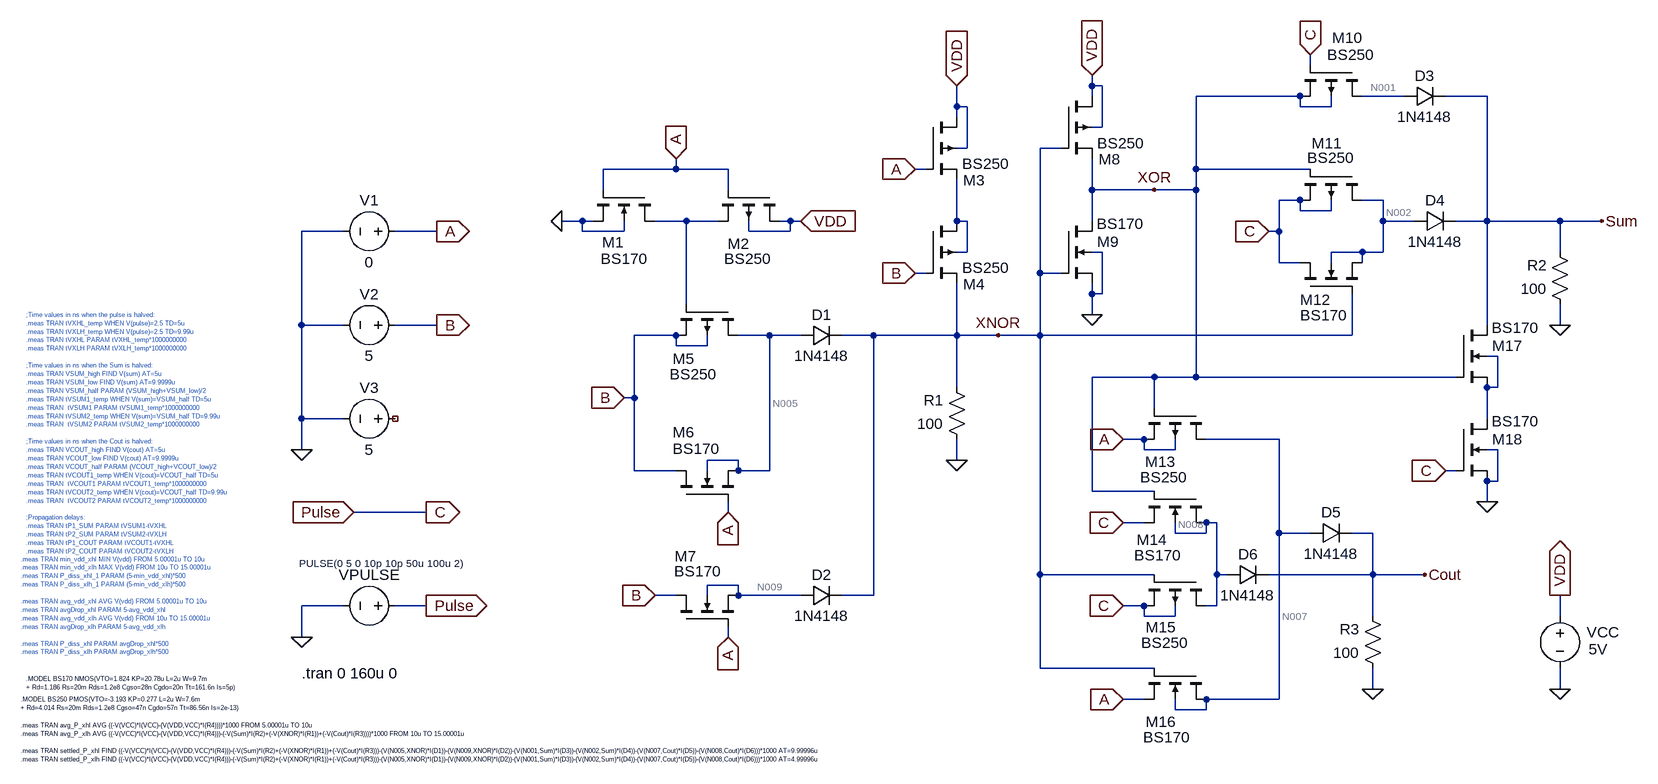
[diagram p0: schematic Lee_Sobelman_1998_Full_Adder.asc]
Lee_Sobelman_1998_Full_Adder.asc, the LTspice schematic file:
Version 4
SHEET 1 3856 1684
WIRE 1584 -368 1584 -384
WIRE 1248 -336 1248 -352
WIRE 1264 -336 1248 -336
WIRE 1248 -320 1248 -336
WIRE 1568 -320 1408 -320
WIRE 1728 -320 1664 -320
WIRE 1856 -320 1792 -320
WIRE 1040 -304 1040 -336
WIRE 1056 -304 1040 -304
WIRE 1568 -304 1568 -320
WIRE 1616 -304 1616 -320
WIRE 1616 -304 1568 -304
WIRE 1040 -288 1040 -304
WIRE 1264 -272 1264 -336
WIRE 1264 -272 1248 -272
WIRE 1056 -240 1056 -304
WIRE 1056 -240 1040 -240
WIRE 1200 -240 1168 -240
WIRE 608 -208 608 -224
WIRE 608 -208 496 -208
WIRE 688 -208 608 -208
WIRE 992 -208 976 -208
WIRE 1408 -208 1408 -320
WIRE 1584 -208 1408 -208
WIRE 496 -176 496 -208
WIRE 688 -176 688 -208
WIRE 1248 -176 1248 -224
WIRE 1344 -176 1248 -176
WIRE 1408 -176 1408 -208
WIRE 1408 -176 1344 -176
WIRE 1568 -160 1536 -160
WIRE 1696 -160 1664 -160
WIRE 1568 -144 1568 -160
WIRE 1616 -144 1616 -160
WIRE 1616 -144 1568 -144
WIRE 464 -128 432 -128
WIRE 480 -128 464 -128
WIRE 624 -128 576 -128
WIRE 672 -128 624 -128
WIRE 784 -128 768 -128
WIRE 800 -128 784 -128
WIRE 1040 -128 1040 -192
WIRE 1056 -128 1040 -128
WIRE 1248 -128 1248 -176
WIRE 1696 -128 1696 -160
WIRE 1744 -128 1696 -128
WIRE 1856 -128 1856 -320
WIRE 1856 -128 1808 -128
WIRE 1968 -128 1856 -128
WIRE 2032 -128 1968 -128
WIRE 96 -112 32 -112
WIRE 240 -112 176 -112
WIRE 464 -112 464 -128
WIRE 528 -112 528 -128
WIRE 528 -112 464 -112
WIRE 720 -112 720 -128
WIRE 784 -112 784 -128
WIRE 784 -112 720 -112
WIRE 1536 -112 1536 -160
WIRE 1536 -112 1520 -112
WIRE 1056 -80 1056 -128
WIRE 1056 -80 1040 -80
WIRE 1264 -80 1248 -80
WIRE 1664 -80 1616 -80
WIRE 1696 -80 1696 -128
WIRE 1696 -80 1664 -80
WIRE 1968 -80 1968 -128
WIRE 1536 -64 1536 -112
WIRE 1568 -64 1536 -64
WIRE 1616 -64 1616 -80
WIRE 1664 -64 1664 -80
WIRE 992 -48 976 -48
WIRE 1168 -48 1168 -240
WIRE 1200 -48 1168 -48
WIRE 1248 -16 1248 -32
WIRE 1264 -16 1264 -80
WIRE 1264 -16 1248 -16
WIRE 624 0 624 -128
WIRE 1248 16 1248 -16
WIRE 32 32 32 -112
WIRE 96 32 32 32
WIRE 240 32 176 32
WIRE 1856 32 1856 -128
WIRE 1968 32 1968 0
WIRE 608 48 544 48
WIRE 752 48 704 48
WIRE 800 48 752 48
WIRE 912 48 864 48
WIRE 1040 48 1040 -32
WIRE 1040 48 912 48
WIRE 1104 48 1040 48
WIRE 1168 48 1168 -48
WIRE 1168 48 1104 48
WIRE 1648 48 1648 -16
WIRE 1648 48 1168 48
WIRE 608 64 608 48
WIRE 656 64 656 48
WIRE 656 64 608 64
WIRE 1872 80 1856 80
WIRE 1344 112 1248 112
WIRE 1408 112 1408 -176
WIRE 1408 112 1344 112
WIRE 1808 112 1408 112
WIRE 1040 128 1040 48
WIRE 1872 128 1872 80
WIRE 1872 128 1856 128
WIRE 544 144 544 48
WIRE 544 144 528 144
WIRE 1344 160 1344 112
WIRE 32 176 32 32
WIRE 96 176 32 176
WIRE 1856 176 1856 128
WIRE 1328 208 1296 208
WIRE 1536 208 1424 208
WIRE 32 224 32 176
WIRE 1328 224 1328 208
WIRE 1376 224 1376 208
WIRE 1376 224 1328 224
WIRE 1872 224 1856 224
WIRE 704 240 656 240
WIRE 1040 240 1040 208
WIRE 544 256 544 144
WIRE 608 256 544 256
WIRE 656 256 656 240
WIRE 704 256 704 240
WIRE 752 256 752 48
WIRE 752 256 704 256
WIRE 1808 256 1792 256
WIRE 1872 272 1872 224
WIRE 1872 272 1856 272
WIRE 1248 288 1248 112
WIRE 1344 288 1248 288
WIRE 1856 304 1856 272
WIRE 224 320 112 320
WIRE 688 320 688 304
WIRE 1328 336 1296 336
WIRE 1440 336 1424 336
WIRE 1376 352 1376 336
WIRE 1424 352 1424 336
WIRE 1424 352 1376 352
WIRE 1536 352 1536 208
WIRE 1584 352 1536 352
WIRE 1680 352 1648 352
WIRE 1168 416 1168 48
WIRE 1344 416 1168 416
WIRE 1440 416 1440 336
WIRE 1456 416 1440 416
WIRE 1680 416 1680 352
WIRE 1680 416 1520 416
WIRE 1760 416 1680 416
WIRE 704 432 656 432
WIRE 608 448 576 448
WIRE 656 448 656 432
WIRE 704 448 704 432
WIRE 800 448 704 448
WIRE 912 448 912 48
WIRE 912 448 864 448
WIRE 96 464 32 464
WIRE 224 464 176 464
WIRE 1328 464 1296 464
WIRE 1440 464 1440 416
WIRE 1440 464 1424 464
WIRE 1328 480 1328 464
WIRE 1376 480 1376 464
WIRE 1376 480 1328 480
WIRE 1680 480 1680 416
WIRE 1968 480 1968 448
WIRE 32 512 32 464
WIRE 688 512 688 496
WIRE 1168 560 1168 416
WIRE 1344 560 1168 560
WIRE 1680 592 1680 560
WIRE 1968 592 1968 560
WIRE 1328 608 1296 608
WIRE 1536 608 1536 352
WIRE 1536 608 1424 608
WIRE 1376 624 1376 608
WIRE 1424 624 1424 608
WIRE 1424 624 1376 624
FLAG 432 -128 0
FLAG 608 -224 A
IOPIN 608 -224 In
FLAG 976 -208 A
IOPIN 976 -208 In
FLAG 976 -48 B
IOPIN 976 -48 In
FLAG 32 512 0
FLAG 1968 448 VDD
IOPIN 1968 448 Out
FLAG 800 -128 VDD
IOPIN 800 -128 In
FLAG 1040 -336 VDD
IOPIN 1040 -336 In
FLAG 528 144 B
IOPIN 528 144 In
FLAG 688 320 A
IOPIN 688 320 In
FLAG 1248 16 0
FLAG 1248 -352 VDD
IOPIN 1248 -352 In
FLAG 1296 208 A
IOPIN 1296 208 In
FLAG 1296 608 A
IOPIN 1296 608 In
FLAG 1296 464 C
IOPIN 1296 464 In
FLAG 1296 336 C
IOPIN 1296 336 In
FLAG 1680 592 0
FLAG 1520 -112 C
IOPIN 1520 -112 In
FLAG 1584 -384 C
IOPIN 1584 -384 In
FLAG 1856 304 0
FLAG 1792 256 C
IOPIN 1792 256 In
FLAG 1760 416 Cout
FLAG 32 224 0
FLAG 224 464 Pulse
IOPIN 224 464 Out
FLAG 224 320 C
IOPIN 224 320 Out
FLAG 112 320 Pulse
IOPIN 112 320 In
FLAG 240 -112 A
IOPIN 240 -112 Out
FLAG 1040 240 0
FLAG 688 512 A
IOPIN 688 512 In
FLAG 576 448 B
IOPIN 576 448 In
FLAG 1968 32 0
FLAG 1104 48 XNOR
FLAG 1344 -176 XOR
FLAG 2032 -128 Sum
FLAG 240 32 B
IOPIN 240 32 Out
FLAG 1968 592 0
SYMBOL nmos4 576 -176 R90
WINDOW 3 106 12 VRight 2
WINDOW 0 81 48 VRight 2
SYMATTR Value BS170
SYMATTR InstName M1
SYMATTR Value2 l=2u w=9.7m
SYMBOL pmos4 768 -176 R90
WINDOW 0 83 47 VRight 2
WINDOW 3 106 14 VRight 2
SYMATTR InstName M2
SYMATTR Value BS250
SYMATTR Value2 l=2u w=7.6m
SYMBOL voltage 192 32 R90
WINDOW 0 -32 56 VBottom 2
WINDOW 3 32 56 VTop 2
SYMATTR InstName V2
SYMATTR Value 5
SYMBOL voltage 1968 464 R0
WINDOW 0 41 41 Left 2
WINDOW 3 44 67 Left 2
SYMATTR InstName VCC
SYMATTR Value 5V
SYMBOL pmos4 992 -288 R0
WINDOW 0 58 97 Left 2
SYMATTR InstName M3
SYMATTR Value2 l=2u w=7.6m
SYMATTR Value BS250
SYMBOL pmos4 992 -128 R0
WINDOW 0 58 97 Left 2
SYMATTR InstName M4
SYMATTR Value2 l=2u w=7.6m
SYMATTR Value BS250
SYMBOL voltage 192 464 R90
WINDOW 0 -32 56 VBottom 2
WINDOW 3 -76 40 VTop 1
WINDOW 123 0 0 Left 0
WINDOW 39 0 0 Left 0
SYMATTR InstName VPULSE
SYMATTR Value PULSE(0 5 0 10p 10p 50u 100u 2)
SYMBOL pmos4 704 0 R90
WINDOW 0 84 67 VRight 2
WINDOW 3 108 34 VRight 2
SYMATTR InstName M5
SYMATTR Value BS250
SYMATTR Value2 l=2u w=7.6m
SYMBOL nmos4 608 304 R270
WINDOW 3 82 -5 VRight 2
WINDOW 0 107 -5 VRight 2
SYMATTR Value BS170
SYMATTR InstName M6
SYMATTR Value2 l=2u w=9.7m
SYMBOL nmos4 1200 -128 R0
WINDOW 3 55 4 Left 2
SYMATTR Value BS170
SYMATTR InstName M9
SYMATTR Value2 l=2u w=9.7m
SYMBOL pmos4 1200 -320 R0
WINDOW 0 58 97 Left 2
SYMATTR InstName M8
SYMATTR Value2 l=2u w=7.6m
SYMATTR Value BS250
SYMBOL pmos4 1424 160 R90
WINDOW 0 82 47 VRight 2
WINDOW 3 106 30 VRight 2
SYMATTR InstName M13
SYMATTR Value BS250
SYMATTR Value2 l=2u w=7.6m
SYMBOL pmos4 1424 416 R90
WINDOW 0 81 46 VRight 2
WINDOW 3 105 28 VRight 2
SYMATTR InstName M15
SYMATTR Value BS250
SYMATTR Value2 l=2u w=7.6m
SYMBOL nmos4 1424 288 R90
WINDOW 0 74 60 VRight 2
WINDOW 3 98 39 VRight 2
SYMATTR InstName M14
SYMATTR Value BS170
SYMATTR Value2 l=2u w=9.7m
SYMBOL nmos4 1424 560 R90
WINDOW 0 82 46 VRight 2
WINDOW 3 106 25 VRight 2
SYMATTR InstName M16
SYMATTR Value BS170
SYMATTR Value2 l=2u w=9.7m
SYMBOL res 1696 576 R180
WINDOW 0 36 76 Left 2
WINDOW 3 36 40 Left 2
SYMATTR InstName R3
SYMATTR Value 100
SYMBOL nmos4 1568 -16 R270
WINDOW 3 -33 0 VRight 2
WINDOW 0 -9 0 VRight 2
SYMATTR Value BS170
SYMATTR InstName M12
SYMATTR Value2 l=2u w=9.7m
SYMBOL pmos4 1664 -368 R90
WINDOW 0 -42 -1 VRight 2
WINDOW 3 -16 -18 VRight 2
SYMATTR InstName M10
SYMATTR Value BS250
SYMATTR Value2 l=2u w=7.6m
SYMBOL pmos4 1664 -208 R90
WINDOW 0 -40 31 VRight 2
WINDOW 3 -17 13 VRight 2
SYMATTR InstName M11
SYMATTR Value BS250
SYMATTR Value2 l=2u w=7.6m
SYMBOL nmos4 1808 32 R0
WINDOW 3 55 4 Left 2
SYMATTR Value BS170
SYMATTR InstName M17
SYMATTR Value2 l=2u w=9.7m
SYMBOL nmos4 1808 176 R0
WINDOW 3 55 4 Left 2
SYMATTR Value BS170
SYMATTR InstName M18
SYMATTR Value2 l=2u w=9.7m
SYMBOL diode 1728 -304 R270
WINDOW 0 32 32 VTop 2
WINDOW 3 0 32 VBottom 2
SYMATTR InstName D3
SYMATTR Value 1N4148
SYMBOL voltage 192 176 R90
WINDOW 0 -32 56 VBottom 2
WINDOW 3 32 56 VTop 2
SYMATTR InstName V3
SYMATTR Value 5
SYMBOL voltage 192 -112 R90
WINDOW 0 -32 56 VBottom 2
WINDOW 3 32 56 VTop 2
SYMATTR InstName V1
SYMATTR Value 0
SYMBOL diode 1456 432 R270
WINDOW 0 32 32 VTop 2
WINDOW 3 0 32 VBottom 2
SYMATTR InstName D6
SYMATTR Value 1N4148
SYMBOL diode 1584 368 R270
WINDOW 0 32 32 VTop 2
WINDOW 3 0 32 VBottom 2
SYMATTR InstName D5
SYMATTR Value 1N4148
SYMBOL res 1056 224 R180
WINDOW 0 36 76 Left 2
WINDOW 3 36 40 Left 2
SYMATTR InstName R1
SYMATTR Value 100
SYMBOL nmos4 608 496 R270
WINDOW 3 85 -3 VRight 2
WINDOW 0 108 -2 VRight 2
SYMATTR Value BS170
SYMATTR InstName M7
SYMATTR Value2 l=2u w=9.7m
SYMBOL diode 1744 -112 R270
WINDOW 0 32 32 VTop 2
WINDOW 3 0 32 VBottom 2
SYMATTR InstName D4
SYMATTR Value 1N4148
SYMBOL diode 800 464 R270
WINDOW 0 32 32 VTop 2
WINDOW 3 0 32 VBottom 2
SYMATTR InstName D2
SYMATTR Value 1N4148
SYMBOL res 1984 16 R180
WINDOW 0 36 76 Left 2
WINDOW 3 36 40 Left 2
SYMATTR InstName R2
SYMATTR Value 100
SYMBOL diode 800 64 R270
WINDOW 0 32 32 VTop 2
WINDOW 3 0 32 VBottom 2
SYMATTR InstName D1
SYMATTR Value 1N4148
TEXT -392 576 Left 0 !.MODEL BS170 NMOS(VTO=1.824 KP=20.78u L=2u W=9.7m\n+ Rd=1.186 Rs=20m Rds=1.2e8 Cgso=28n Cgdo=20n Tt=161.6n Is=5p)
TEXT -400 608 Left 0 !.MODEL BS250 PMOS(VTO=-3.193 KP=0.277 L=2u W=7.6m\n+ Rd=4.014 Rs=20m Rds=1.2e8 Cgso=47n Cgdo=57n Tt=86.56n Is=2e-13)
TEXT 32 568 Left 2 !.tran 0 160u 0
TEXT -392 16 Left 0 ;;Time values in ns when the pulse is halved:\n.meas TRAN tVXHL_temp WHEN V(pulse)=2.5 TD=5u\n.meas TRAN tVXLH_temp WHEN V(pulse)=2.5 TD=9.99u\n.meas TRAN tVXHL PARAM tVXHL_temp*1000000000\n.meas TRAN tVXLH PARAM tVXLH_temp*1000000000\n \n;Time values in ns when the Sum is halved:\n.meas TRAN VSUM_high FIND V(sum) AT=5u\n.meas TRAN VSUM_low FIND V(sum) AT=9.9999u\n.meas TRAN VSUM_half PARAM (VSUM_high+VSUM_low)/2\n.meas TRAN tVSUM1_temp WHEN V(sum)=VSUM_half TD=5u\n.meas TRAN  tVSUM1 PARAM tVSUM1_temp*1000000000\n.meas TRAN tVSUM2_temp WHEN V(sum)=VSUM_half TD=9.99u\n.meas TRAN  tVSUM2 PARAM tVSUM2_temp*1000000000\n \n;Time values in ns when the Cout is halved:\n.meas TRAN VCOUT_high FIND V(cout) AT=5u\n.meas TRAN VCOUT_low FIND V(cout) AT=9.9999u\n.meas TRAN VCOUT_half PARAM (VCOUT_high+VCOUT_low)/2\n.meas TRAN tVCOUT1_temp WHEN V(cout)=VCOUT_half TD=5u\n.meas TRAN  tVCOUT1 PARAM tVCOUT1_temp*1000000000\n.meas TRAN tVCOUT2_temp WHEN V(cout)=VCOUT_half TD=9.99u\n.meas TRAN  tVCOUT2 PARAM tVCOUT2_temp*1000000000\n \n;Propagation delays:\n.meas TRAN tP1_SUM PARAM tVSUM1-tVXHL\n.meas TRAN tP2_SUM PARAM tVSUM2-tVXLH\n.meas TRAN tP1_COUT PARAM tVCOUT1-tVXHL\n.meas TRAN tP2_COUT PARAM tVCOUT2-tVXLH
TEXT -400 392 Left 0 ;.meas TRAN min_vdd_xhl MIN V(vdd) FROM 5.00001u TO 10u\n.meas TRAN min_vdd_xlh MAX V(vdd) FROM 10u TO 15.00001u\n.meas TRAN P_diss_xhl_1 PARAM (5-min_vdd_xhl)*500\n.meas TRAN P_diss_xlh_1 PARAM (5-min_vdd_xlh)*500\n \n.meas TRAN avg_vdd_xhl AVG V(vdd) FROM 5.00001u TO 10u\n.meas TRAN avgDrop_xhl PARAM 5-avg_vdd_xhl\n.meas TRAN avg_vdd_xlh AVG V(vdd) FROM 10u TO 15.00001u\n.meas TRAN avgDrop_xlh PARAM 5-avg_vdd_xlh\n \n.meas TRAN P_diss_xhl PARAM avgDrop_xhl*500\n.meas TRAN P_diss_xlh PARAM avgDrop_xlh*500
TEXT -400 648 Left 0 !.meas TRAN avg_P_xhl AVG ((-V(VCC)*I(VCC)-(V(VDD,VCC)*I(R4))))*1000 FROM 5.00001u TO 10u\n.meas TRAN avg_P_xlh AVG ((-V(VCC)*I(VCC)-(V(VDD,VCC)*I(R4)))-(-V(Sum)*I(R2)+(-V(XNOR)*I(R1))+(-V(Cout)*I(R3))))*1000 FROM 10u TO 15.00001u\n \n.meas TRAN settled_P_xhl FIND ((-V(VCC)*I(VCC)-(V(VDD,VCC)*I(R4)))-(-V(Sum)*I(R2)+(-V(XNOR)*I(R1))+(-V(Cout)*I(R3)))-(V(N005,XNOR)*I(D1))-(V(N009,XNOR)*I(D2))-(V(N001,Sum)*I(D3))-(V(N002,Sum)*I(D4))-(V(N007,Cout)*I(D5))-(V(N008,Cout)*I(D6)))*1000 AT=9.99996u\n.meas TRAN settled_P_xlh FIND ((-V(VCC)*I(VCC)-(V(VDD,VCC)*I(R4)))-(-V(Sum)*I(R2)+(-V(XNOR)*I(R1))+(-V(Cout)*I(R3)))-(V(N005,XNOR)*I(D1))-(V(N009,XNOR)*I(D2))-(V(N001,Sum)*I(D3))-(V(N002,Sum)*I(D4))-(V(N007,Cout)*I(D5))-(V(N008,Cout)*I(D6)))*1000 AT=4.99996u

The netlist it stands for:
* Lee_Sobelman_1998_Full_Adder.asc
M1 N003 A 0 0 BS170 l=2u w=9.7m
M2 VDD A N003 VDD BS250 l=2u w=7.6m
V2 B 0 5
VCC VDD 0 5V
M3 VDD A N004 VDD BS250 l=2u w=7.6m
M4 N004 B XNOR N004 BS250 l=2u w=7.6m
VPULSE Pulse 0 PULSE(0 5 0 10p 10p 50u 100u 2)
M5 N005 N003 B B BS250 l=2u w=7.6m
M6 B A N005 N005 BS170 l=2u w=9.7m
M9 XOR XNOR 0 0 BS170 l=2u w=9.7m
M8 VDD XNOR XOR VDD BS250 l=2u w=7.6m
M13 N007 XOR A A BS250 l=2u w=7.6m
M15 N008 XNOR Pulse Pulse BS250 l=2u w=7.6m
M14 N008 XOR Pulse N008 BS170 l=2u w=9.7m
M16 N007 XNOR A N007 BS170 l=2u w=9.7m
R3 0 Cout 100
M12 Pulse XNOR N002 N002 BS170 l=2u w=9.7m
M10 N001 Pulse XOR XOR BS250 l=2u w=7.6m
M11 N002 XOR Pulse Pulse BS250 l=2u w=7.6m
M17 Sum XOR N006 N006 BS170 l=2u w=9.7m
M18 N006 Pulse 0 0 BS170 l=2u w=9.7m
D3 N001 Sum 1N4148
V3 NC_01 0 5
V1 A 0 0
D6 N008 Cout 1N4148
D5 N007 Cout 1N4148
R1 0 XNOR 100
M7 B A N009 N009 BS170 l=2u w=9.7m
D4 N002 Sum 1N4148
D2 N009 XNOR 1N4148
R2 0 Sum 100
D1 N005 XNOR 1N4148
.model D D
.lib standard.dio
.model NMOS NMOS
.model PMOS PMOS
.lib standard.mos
.MODEL BS170 NMOS(VTO=1.824 KP=20.78u L=2u W=9.7m
+ Rd=1.186 Rs=20m Rds=1.2e8 Cgso=28n Cgdo=20n Tt=161.6n Is=5p)
.MODEL BS250 PMOS(VTO=-3.193 KP=0.277 L=2u W=7.6m
+ Rd=4.014 Rs=20m Rds=1.2e8 Cgso=47n Cgdo=57n Tt=86.56n Is=2e-13)
.tran 0 160u 0
* ;Time values in ns when the pulse is halved:
* .meas TRAN tVXHL_temp WHEN V(pulse)=2.5 TD=5u
* .meas TRAN tVXLH_temp WHEN V(pulse)=2.5 TD=9.99u
* .meas TRAN tVXHL PARAM tVXHL_temp*1000000000
* .meas TRAN tVXLH PARAM tVXLH_temp*1000000000
* ;Time values in ns when the Sum is halved:
* .meas TRAN VSUM_high FIND V(sum) AT=5u
* .meas TRAN VSUM_low FIND V(sum) AT=9.9999u
* .meas TRAN VSUM_half PARAM (VSUM_high+VSUM_low)/2
* .meas TRAN tVSUM1_temp WHEN V(sum)=VSUM_half TD=5u
* .meas TRAN  tVSUM1 PARAM tVSUM1_temp*1000000000
* .meas TRAN tVSUM2_temp WHEN V(sum)=VSUM_half TD=9.99u
* .meas TRAN  tVSUM2 PARAM tVSUM2_temp*1000000000
* ;Time values in ns when the Cout is halved:
* .meas TRAN VCOUT_high FIND V(cout) AT=5u
* .meas TRAN VCOUT_low FIND V(cout) AT=9.9999u
* .meas TRAN VCOUT_half PARAM (VCOUT_high+VCOUT_low)/2
* .meas TRAN tVCOUT1_temp WHEN V(cout)=VCOUT_half TD=5u
* .meas TRAN  tVCOUT1 PARAM tVCOUT1_temp*1000000000
* .meas TRAN tVCOUT2_temp WHEN V(cout)=VCOUT_half TD=9.99u
* .meas TRAN  tVCOUT2 PARAM tVCOUT2_temp*1000000000
* ;Propagation delays:
* .meas TRAN tP1_SUM PARAM tVSUM1-tVXHL
* .meas TRAN tP2_SUM PARAM tVSUM2-tVXLH
* .meas TRAN tP1_COUT PARAM tVCOUT1-tVXHL
* .meas TRAN tP2_COUT PARAM tVCOUT2-tVXLH
* .meas TRAN min_vdd_xhl MIN V(vdd) FROM 5.00001u TO 10u
* .meas TRAN min_vdd_xlh MAX V(vdd) FROM 10u TO 15.00001u
* .meas TRAN P_diss_xhl_1 PARAM (5-min_vdd_xhl)*500
* .meas TRAN P_diss_xlh_1 PARAM (5-min_vdd_xlh)*500
* .meas TRAN avg_vdd_xhl AVG V(vdd) FROM 5.00001u TO 10u
* .meas TRAN avgDrop_xhl PARAM 5-avg_vdd_xhl
* .meas TRAN avg_vdd_xlh AVG V(vdd) FROM 10u TO 15.00001u
* .meas TRAN avgDrop_xlh PARAM 5-avg_vdd_xlh
* .meas TRAN P_diss_xhl PARAM avgDrop_xhl*500
* .meas TRAN P_diss_xlh PARAM avgDrop_xlh*500
.meas TRAN avg_P_xhl AVG ((-V(VCC)*I(VCC)-(V(VDD,VCC)*I(R4))))*1000 FROM 5.00001u TO 10u
.meas TRAN avg_P_xlh AVG ((-V(VCC)*I(VCC)-(V(VDD,VCC)*I(R4)))-(-V(Sum)*I(R2)+(-V(XNOR)*I(R1))+(-V(Cout)*I(R3))))*1000 FROM 10u TO 15.00001u
.meas TRAN settled_P_xhl FIND ((-V(VCC)*I(VCC)-(V(VDD,VCC)*I(R4)))-(-V(Sum)*I(R2)+(-V(XNOR)*I(R1))+(-V(Cout)*I(R3)))-(V(N005,XNOR)*I(D1))-(V(N009,XNOR)*I(D2))-(V(N001,Sum)*I(D3))-(V(N002,Sum)*I(D4))-(V(N007,Cout)*I(D5))-(V(N008,Cout)*I(D6)))*1000 AT=9.99996u
.meas TRAN settled_P_xlh FIND ((-V(VCC)*I(VCC)-(V(VDD,VCC)*I(R4)))-(-V(Sum)*I(R2)+(-V(XNOR)*I(R1))+(-V(Cout)*I(R3)))-(V(N005,XNOR)*I(D1))-(V(N009,XNOR)*I(D2))-(V(N001,Sum)*I(D3))-(V(N002,Sum)*I(D4))-(V(N007,Cout)*I(D5))-(V(N008,Cout)*I(D6)))*1000 AT=4.99996u
.backanno
.end